# Altium schematic sheet 70_Signalleuchten.SchDoc
size A3; SheetNumber: 8; SheetTotal: 12
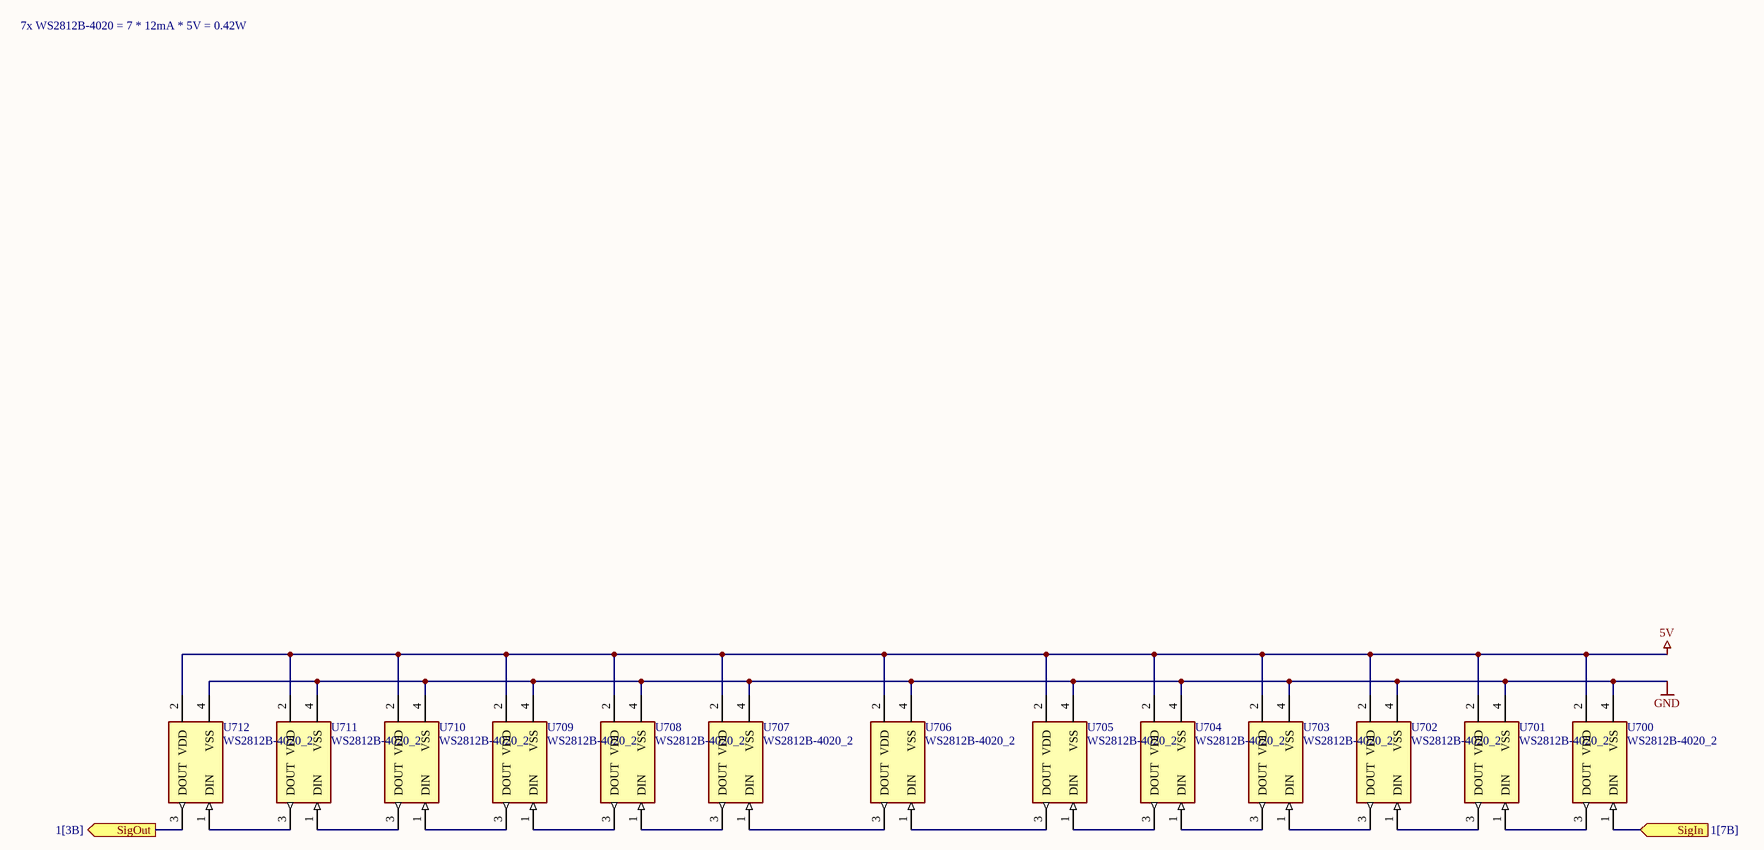
[diagram p0: 70_Signalleuchten.SchDoc]

## Parts
U700  WS2812B-4020_2  [LED_WS2812B-4020]
U701  WS2812B-4020_2  [LED_WS2812B-4020]
U702  WS2812B-4020_2  [LED_WS2812B-4020]
U703  WS2812B-4020_2  [LED_WS2812B-4020]
U704  WS2812B-4020_2  [LED_WS2812B-4020]
U705  WS2812B-4020_2  [LED_WS2812B-4020]
U706  WS2812B-4020_2  [LED_WS2812B-4020]
U707  WS2812B-4020_2  [LED_WS2812B-4020]
U708  WS2812B-4020_2  [LED_WS2812B-4020]
U709  WS2812B-4020_2  [LED_WS2812B-4020]
U710  WS2812B-4020_2  [LED_WS2812B-4020]
U711  WS2812B-4020_2  [LED_WS2812B-4020]
U712  WS2812B-4020_2  [LED_WS2812B-4020]

## Ports
SigIn (in, see 1[7B]), SigOut (out, see 1[3B])

## Nets
5V: U700.2(VDD) U701.2(VDD) U702.2(VDD) U703.2(VDD) U704.2(VDD) U705.2(VDD) U706.2(VDD) U707.2(VDD) U708.2(VDD) U709.2(VDD) U710.2(VDD) U711.2(VDD) U712.2(VDD)
GND: U700.4(VSS) U701.4(VSS) U702.4(VSS) U703.4(VSS) U704.4(VSS) U705.4(VSS) U706.4(VSS) U707.4(VSS) U708.4(VSS) U709.4(VSS) U710.4(VSS) U711.4(VSS) U712.4(VSS)
SigIn: U700.1(DIN) ; port SigIn
SigOut: U712.3(DOUT) ; port SigOut
NetU700_3: U700.3(DOUT) U701.1(DIN)
NetU701_3: U701.3(DOUT) U702.1(DIN)
NetU702_3: U702.3(DOUT) U703.1(DIN)
NetU703_3: U703.3(DOUT) U704.1(DIN)
NetU704_3: U704.3(DOUT) U705.1(DIN)
NetU705_3: U705.3(DOUT) U706.1(DIN)
NetU706_3: U706.3(DOUT) U707.1(DIN)
NetU707_3: U707.3(DOUT) U708.1(DIN)
NetU708_3: U708.3(DOUT) U709.1(DIN)
NetU709_3: U709.3(DOUT) U710.1(DIN)
NetU710_3: U710.3(DOUT) U711.1(DIN)
NetU711_3: U711.3(DOUT) U712.1(DIN)

## Notes on the sheet
- 7x WS2812B-4020 = 7 * 12mA * 5V = 0.42W

## Library data of the parts
U700-U712 = WS2812B-4020_2: 12mA RGB SMD,2x4mm Light Emitting Diodes; MF: Worldsemi; Price: None; MP: WS2812B-4020; Availability: Not in stock; SnapEDA_Link: https://www.snapeda.com/parts/WS2812B-4020/Worldsemi/view-part/?ref=snap; Check_prices: https://www.snapeda.com/parts/WS2812B-4020/Worldsemi/view-part/?ref=eda; Value: *; Package: Package